# Altium schematic sheet power.SchDoc: POWER
size A3; DocumentNumber: 2; Revision: 0; SheetNumber: 2; SheetTotal: 19
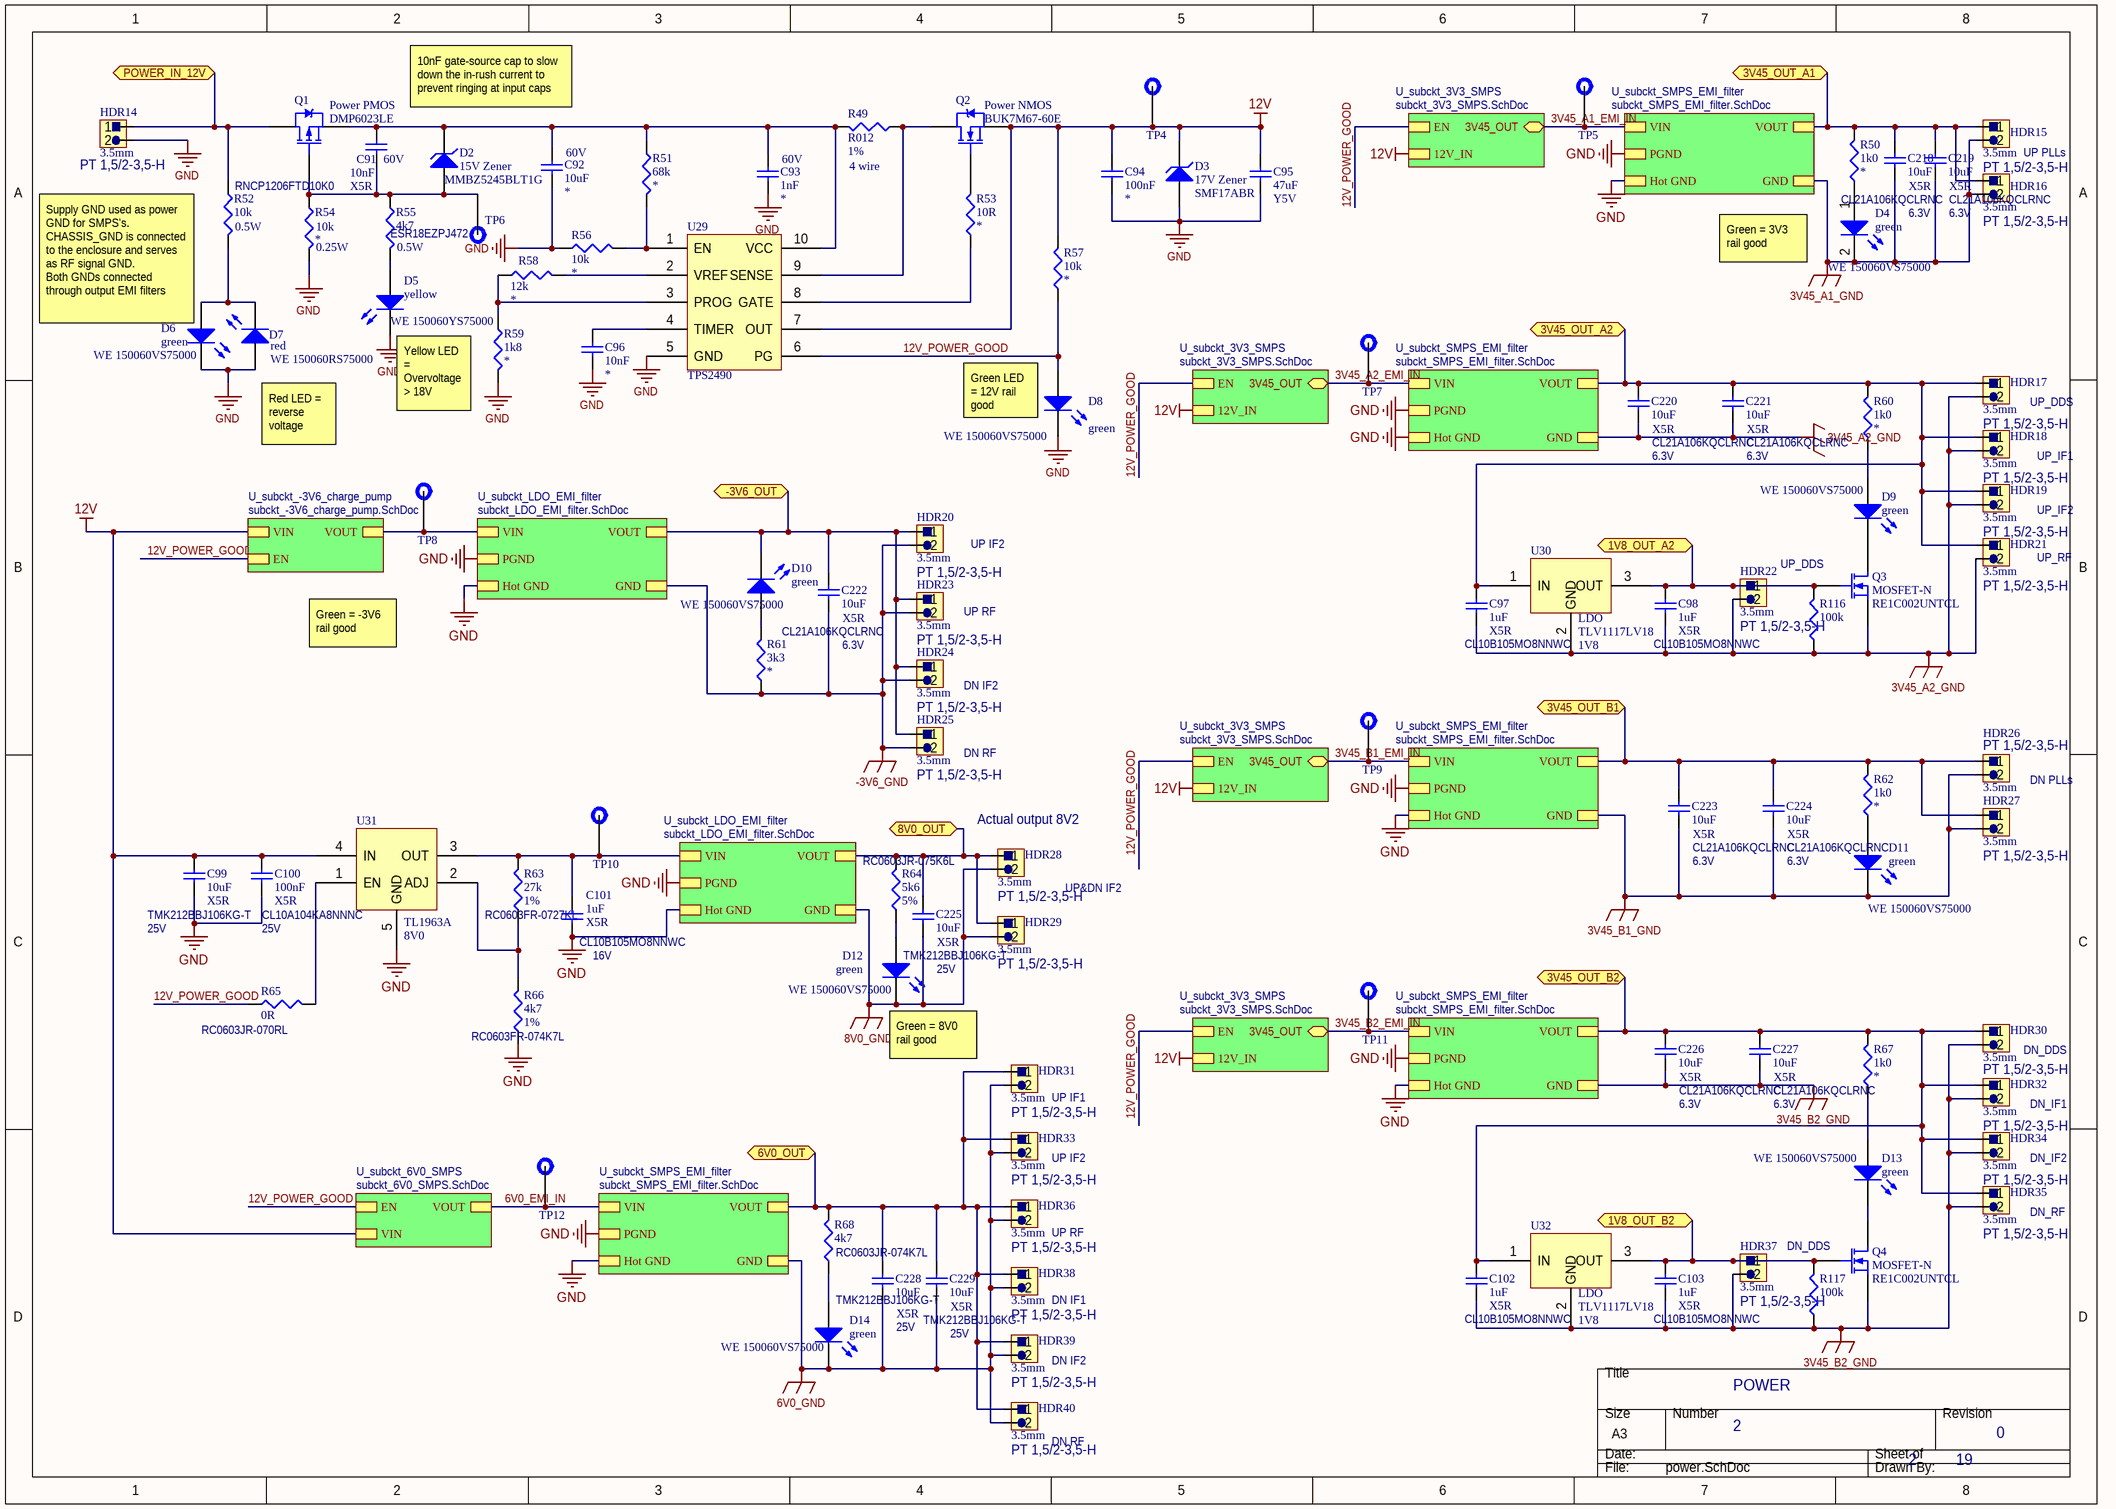
[diagram p0: power.SchDoc]

## Parts
C91  60V  value 10nF  Dielectric: X5R  [TBD]
C92  60V  value 10uF  [TBD]
C93  60V  value 1nF  [TBD]
C94  value 100nF  [TBD]  (hidden comment: Capacitor)
C95  value 47uF  Dielectric: Y5V  [TBD]  (hidden comment: Capacitor)
C96  value 10nF  [TBD]  (hidden comment: Capacitor)
C97  value 1uF  Dielectric: X5R  Model: CL10B105MO8NNWC  [CAP0603]  (hidden comment: Capacitor)
C98  value 1uF  Dielectric: X5R  Model: CL10B105MO8NNWC  [CAP0603]  (hidden comment: Capacitor)
C99  value 10uF  Dielectric: X5R  Model: TMK212BBJ106KG-T  Voltage: 25V  [CAP0805]  (hidden comment: Capacitor)
C100  value 100nF  Dielectric: X5R  Model: CL10A104KA8NNNC  Voltage: 25V  [CAP0603]  (hidden comment: Capacitor)
C101  value 1uF  Dielectric: X5R  Model: CL10B105MO8NNWC  Voltage: 16V  [CAP0603]  (hidden comment: Capacitor)
C102  value 1uF  Dielectric: X5R  Model: CL10B105MO8NNWC  [CAP0603]  (hidden comment: Capacitor)
C103  value 1uF  Dielectric: X5R  Model: CL10B105MO8NNWC  [CAP0603]  (hidden comment: Capacitor)
C218  value 10uF  Dielectric: X5R  Model: CL21A106KQCLRNC  Voltage: 6.3V  [CAP0805]  (hidden comment: Capacitor)
C219  value 10uF  Dielectric: X5R  Model: CL21A106KQCLRNC  Voltage: 6.3V  [CAP0805]  (hidden comment: Capacitor)
C220  value 10uF  Dielectric: X5R  Model: CL21A106KQCLRNC  Voltage: 6.3V  [CAP0805]  (hidden comment: Capacitor)
C221  value 10uF  Dielectric: X5R  Model: CL21A106KQCLRNC  Voltage: 6.3V  [CAP0805]  (hidden comment: Capacitor)
C222  value 10uF  Dielectric: X5R  Model: CL21A106KQCLRNC  Voltage: 6.3V  [CAP0805]  (hidden comment: Capacitor)
C223  value 10uF  Dielectric: X5R  Model: CL21A106KQCLRNC  Voltage: 6.3V  [CAP0805]  (hidden comment: Capacitor)
C224  value 10uF  Dielectric: X5R  Model: CL21A106KQCLRNC  Voltage: 6.3V  [CAP0805]  (hidden comment: Capacitor)
C225  value 10uF  Dielectric: X5R  Model: TMK212BBJ106KG-T  Voltage: 25V  [CAP0805]  (hidden comment: Capacitor)
C226  value 10uF  Dielectric: X5R  Model: CL21A106KQCLRNC  Voltage: 6.3V  [CAP0805]  (hidden comment: Capacitor)
C227  value 10uF  Dielectric: X5R  Model: CL21A106KQCLRNC  Voltage: 6.3V  [CAP0805]  (hidden comment: Capacitor)
C228  value 10uF  Dielectric: X5R  Model: TMK212BBJ106KG-T  Voltage: 25V  [CAP0805]  (hidden comment: Capacitor)
C229  value 10uF  Dielectric: X5R  Model: TMK212BBJ106KG-T  Voltage: 25V  [CAP0805]  (hidden comment: Capacitor)
D2  15V Zener  Model: MMBZ5245BLT1G  [TBD]
D3  17V Zener  Model: SMF17ABR  [TBD]
D4  Colour: green  Model: WE 150060VS75000  [LED0603]  (hidden comment: LED)
D5  Colour: yellow  Model: WE 150060YS75000  [LED0603]  (hidden comment: LED)
D6  Colour: green  Model: WE 150060VS75000  [LED0603]  (hidden comment: LED)
D7  Colour: red  Model: WE 150060RS75000  [LED0603]  (hidden comment: LED)
D8  Colour: green  Model: WE 150060VS75000  [LED0603]  (hidden comment: LED)
D9  Colour: green  Model: WE 150060VS75000  [LED0603]  (hidden comment: LED)
D10  Colour: green  Model: WE 150060VS75000  [LED0603]  (hidden comment: LED)
D11  Colour: green  Model: WE 150060VS75000  [LED0603]  (hidden comment: LED)
D12  Colour: green  Model: WE 150060VS75000  [LED0603]  (hidden comment: LED)
D13  Colour: green  Model: WE 150060VS75000  [LED0603]  (hidden comment: LED)
D14  Colour: green  Model: WE 150060VS75000  [LED0603]  (hidden comment: LED)
HDR14  Pitch: 3.5mm  Model: PT 1,5/2-3,5-H  [2X 3.5mm TH screw terminal - interlock]  (hidden comment: Header 2 pins)
HDR15  Pitch: 3.5mm  Model: PT 1,5/2-3,5-H  [2X 3.5mm TH screw terminal - interlock]  (hidden comment: Header 2 pins)
HDR16  Pitch: 3.5mm  Model: PT 1,5/2-3,5-H  [2X 3.5mm TH screw terminal - interlock]  (hidden comment: Header 2 pins)
HDR17  Pitch: 3.5mm  Model: PT 1,5/2-3,5-H  [2X 3.5mm TH screw terminal - interlock]  (hidden comment: Header 2 pins)
HDR18  Pitch: 3.5mm  Model: PT 1,5/2-3,5-H  [2X 3.5mm TH screw terminal - interlock]  (hidden comment: Header 2 pins)
HDR19  Pitch: 3.5mm  Model: PT 1,5/2-3,5-H  [2X 3.5mm TH screw terminal - interlock]  (hidden comment: Header 2 pins)
HDR20  Pitch: 3.5mm  Model: PT 1,5/2-3,5-H  [2X 3.5mm TH screw terminal - interlock]  (hidden comment: Header 2 pins)
HDR21  Pitch: 3.5mm  Model: PT 1,5/2-3,5-H  [2X 3.5mm TH screw terminal - interlock]  (hidden comment: Header 2 pins)
HDR22  Pitch: 3.5mm  Model: PT 1,5/2-3,5-H  [2X 3.5mm TH screw terminal - interlock]  (hidden comment: Header 2 pins)
HDR23  Pitch: 3.5mm  Model: PT 1,5/2-3,5-H  [2X 3.5mm TH screw terminal - interlock]  (hidden comment: Header 2 pins)
HDR24  Pitch: 3.5mm  Model: PT 1,5/2-3,5-H  [2X 3.5mm TH screw terminal - interlock]  (hidden comment: Header 2 pins)
HDR25  Pitch: 3.5mm  Model: PT 1,5/2-3,5-H  [2X 3.5mm TH screw terminal - interlock]  (hidden comment: Header 2 pins)
HDR26  Pitch: 3.5mm  Model: PT 1,5/2-3,5-H  [2X 3.5mm TH screw terminal - interlock]  (hidden comment: Header 2 pins)
HDR27  Pitch: 3.5mm  Model: PT 1,5/2-3,5-H  [2X 3.5mm TH screw terminal - interlock]  (hidden comment: Header 2 pins)
HDR28  Pitch: 3.5mm  Model: PT 1,5/2-3,5-H  [2X 3.5mm TH screw terminal - interlock]  (hidden comment: Header 2 pins)
HDR29  Pitch: 3.5mm  Model: PT 1,5/2-3,5-H  [2X 3.5mm TH screw terminal - interlock]  (hidden comment: Header 2 pins)
HDR30  Pitch: 3.5mm  Model: PT 1,5/2-3,5-H  [2X 3.5mm TH screw terminal - interlock]  (hidden comment: Header 2 pins)
HDR31  Pitch: 3.5mm  Model: PT 1,5/2-3,5-H  [2X 3.5mm TH screw terminal - interlock]  (hidden comment: Header 2 pins)
HDR32  Pitch: 3.5mm  Model: PT 1,5/2-3,5-H  [2X 3.5mm TH screw terminal - interlock]  (hidden comment: Header 2 pins)
HDR33  Pitch: 3.5mm  Model: PT 1,5/2-3,5-H  [2X 3.5mm TH screw terminal - interlock]  (hidden comment: Header 2 pins)
HDR34  Pitch: 3.5mm  Model: PT 1,5/2-3,5-H  [2X 3.5mm TH screw terminal - interlock]  (hidden comment: Header 2 pins)
HDR35  Pitch: 3.5mm  Model: PT 1,5/2-3,5-H  [2X 3.5mm TH screw terminal - interlock]  (hidden comment: Header 2 pins)
HDR36  Pitch: 3.5mm  Model: PT 1,5/2-3,5-H  [2X 3.5mm TH screw terminal - interlock]  (hidden comment: Header 2 pins)
HDR37  Pitch: 3.5mm  Model: PT 1,5/2-3,5-H  [2X 3.5mm TH screw terminal - interlock]  (hidden comment: Header 2 pins)
HDR38  Pitch: 3.5mm  Model: PT 1,5/2-3,5-H  [2X 3.5mm TH screw terminal - interlock]  (hidden comment: Header 2 pins)
HDR39  Pitch: 3.5mm  Model: PT 1,5/2-3,5-H  [2X 3.5mm TH screw terminal - interlock]  (hidden comment: Header 2 pins)
HDR40  Pitch: 3.5mm  Model: PT 1,5/2-3,5-H  [2X 3.5mm TH screw terminal - interlock]  (hidden comment: Header 2 pins)
Q1  Power PMOS  Model: DMP6023LE
Q2  Power NMOS  Model: BUK7M67-60E  [TBD]
Q3  MOSFET-N  Model: RE1C002UNTCL  [SC89 3 leads]
Q4  MOSFET-N  Model: RE1C002UNTCL  [SC89 3 leads]
R49  4 wire  value R012  Type: 1%  [TBD]
R50  value 1k0  [RES0603]  (hidden comment: Resistor)
R51  value 68k  [TBD]  (hidden comment: Resistor)
R52  0.5W  value 10k  Model: RNCP1206FTD10K0  [RES1206]
R53  value 10R  [TBD]  (hidden comment: Resistor)
R54  0.25W  value 10k  [TBD]
R55  0.5W  value 4k7  Model: ESR18EZPJ472  [RES1206]
R56  value 10k  [TBD]  (hidden comment: Resistor)
R57  value 10k  [TBD]  (hidden comment: Resistor)
R58  value 12k  [TBD]  (hidden comment: Resistor)
R59  value 1k8  [TBD]  (hidden comment: Resistor)
R60  value 1k0  [RES0603]  (hidden comment: Resistor)
R61  value 3k3  [RES0603]  (hidden comment: Resistor)
R62  value 1k0  [RES0603]  (hidden comment: Resistor)
R63  value 27k  Type: 1%  Model: RC0603FR-0727KL  [RES0603]  (hidden comment: Resistor)
R64  value 5k6  Type: 5%  Model: RC0603JR-075K6L  [RES0603]  (hidden comment: Resistor)
R65  value 0R  Model: RC0603JR-070RL  [RES0603]  (hidden comment: Resistor)
R66  value 4k7  Type: 1%  Model: RC0603FR-074K7L  [RES0603]  (hidden comment: Resistor)
R67  value 1k0  [RES0603]  (hidden comment: Resistor)
R68  value 4k7  Model: RC0603JR-074K7L  [RES0603]  (hidden comment: Resistor)
R116  value 100k  [RES0603]  (hidden comment: Resistor)
R117  value 100k  [RES0603]  (hidden comment: Resistor)
TP4  Test point  [1XHeader 100mil]  (value not drawn)  (no BOM)
TP5  Test point  [1XHeader 100mil]  (value not drawn)  (no BOM)
TP6  Test point  [1XHeader 100mil]  (value not drawn)  (no BOM)
TP7  Test point  [1XHeader 100mil]  (value not drawn)  (no BOM)
TP8  Test point  [1XHeader 100mil]  (value not drawn)  (no BOM)
TP9  Test point  [1XHeader 100mil]  (value not drawn)  (no BOM)
TP10  Test point  [1XHeader 100mil]  (value not drawn)  (no BOM)
TP11  Test point  [1XHeader 100mil]  (value not drawn)  (no BOM)
TP12  Test point  [1XHeader 100mil]  (value not drawn)  (no BOM)
U29  TPS2490  [TBD]
U30  LDO  Model: TLV1117LV18  Voltage: 1V8  [SOT223 (4)]
U31  Model: TL1963A  Voltage: 8V0  [SOT223 (6)]  (hidden comment: LDO)
U32  LDO  Model: TLV1117LV18  Voltage: 1V8  [SOT223 (4)]

## Sub-sheets
U_subckt_3V3_SMPS = subckt_3V3_SMPS.SchDoc: EN, 12V_IN, 3V45_OUT
U_subckt_3V3_SMPS = subckt_3V3_SMPS.SchDoc: EN, 12V_IN, 3V45_OUT
U_subckt_3V3_SMPS = subckt_3V3_SMPS.SchDoc: EN, 12V_IN, 3V45_OUT
U_subckt_3V3_SMPS = subckt_3V3_SMPS.SchDoc: EN, 12V_IN, 3V45_OUT
U_subckt_6V0_SMPS = subckt_6V0_SMPS.SchDoc: EN, VIN, VOUT
U_subckt_-3V6_charge_pump = subckt_-3V6_charge_pump.SchDoc: VIN, EN, VOUT
U_subckt_LDO_EMI_filter = subckt_LDO_EMI_filter.SchDoc: VIN, PGND, VOUT, GND, Hot GND
U_subckt_LDO_EMI_filter = subckt_LDO_EMI_filter.SchDoc: VIN, PGND, VOUT, GND, Hot GND
U_subckt_SMPS_EMI_filter = subckt_SMPS_EMI_filter.SchDoc: VIN, PGND, VOUT, GND, Hot GND
U_subckt_SMPS_EMI_filter = subckt_SMPS_EMI_filter.SchDoc: VIN, PGND, VOUT, GND, Hot GND
U_subckt_SMPS_EMI_filter = subckt_SMPS_EMI_filter.SchDoc: VIN, PGND, VOUT, GND, Hot GND
U_subckt_SMPS_EMI_filter = subckt_SMPS_EMI_filter.SchDoc: VIN, PGND, VOUT, GND, Hot GND
U_subckt_SMPS_EMI_filter = subckt_SMPS_EMI_filter.SchDoc: VIN, PGND, VOUT, GND, Hot GND

## Ports
1V8_OUT_A2, 1V8_OUT_B2, 3V45_OUT_A1, 3V45_OUT_A2, 3V45_OUT_B1, 3V45_OUT_B2, 6V0_OUT, 8V0_OUT, -3V6_OUT, POWER_IN_12V

## Nets
3V45_A1_GND: C218.1 C219.1 D4.2(K) HDR15.2 HDR16.2 ; sheet U_subckt_SMPS_EMI_filter/GND
3V45_A2_GND: C97.1 C98.1 C220.1 C221.1 HDR17.2 HDR18.2 HDR19.2 HDR21.2 HDR22.2 Q3.3(S) R116.1 U30.2(GND) ; sheet U_subckt_SMPS_EMI_filter/GND
3V45_B1_GND: C223.1 C224.1 D11.2(K) HDR26.2 HDR27.2 ; sheet U_subckt_SMPS_EMI_filter/GND
3V45_B2_GND: C102.1 C103.1 C226.1 C227.1 HDR30.2 HDR32.2 HDR34.2 HDR35.2 HDR37.2 Q4.3(S) R117.1 U32.2(GND) ; sheet U_subckt_SMPS_EMI_filter/GND
6V0_GND: C228.1 C229.1 D14.2(K) HDR31.2 HDR33.2 HDR36.2 HDR38.2 HDR39.2 HDR40.2 ; sheet U_subckt_SMPS_EMI_filter/GND
8V0_GND: C225.1 D12.2(K) HDR28.2 HDR29.2 ; sheet U_subckt_LDO_EMI_filter/GND
12V: C94.1 C95.2 C99.2 C100.2 D3.2(K) Q2.3(S) R57.2 TP4.1 U29.7(OUT) U31.4(IN) ; sheet U_subckt_3V3_SMPS/12V_IN, sheet U_subckt_3V3_SMPS/12V_IN, sheet U_subckt_3V3_SMPS/12V_IN, sheet U_subckt_3V3_SMPS/12V_IN, sheet U_subckt_6V0_SMPS/VIN, sheet U_subckt_-3V6_charge_pump/VIN
-3V6_GND: C222.1 HDR20.2 HDR23.2 HDR24.2 HDR25.2 R61.2 ; sheet U_subckt_LDO_EMI_filter/GND
GND: C92.2 C93.2 C94.2 C95.1 C96.2 C99.1 C100.1 C101.1 D3.1(A) D5.2(K) D6.2(K) D7.1(A) D8.2(K) HDR14.2 R54.2 R56.1 R59.2 R66.1 U29.5(GND) U31.5(GND) ; sheet U_subckt_SMPS_EMI_filter/PGND, sheet U_subckt_SMPS_EMI_filter/Hot GND, sheet U_subckt_SMPS_EMI_filter/PGND, sheet U_subckt_SMPS_EMI_filter/Hot GND, sheet U_subckt_SMPS_EMI_filter/PGND, sheet U_subckt_SMPS_EMI_filter/Hot GND, sheet U_subckt_SMPS_EMI_filter/PGND, sheet U_subckt_SMPS_EMI_filter/Hot GND, sheet U_subckt_SMPS_EMI_filter/PGND, sheet U_subckt_SMPS_EMI_filter/Hot GND, sheet U_subckt_LDO_EMI_filter/PGND, sheet U_subckt_LDO_EMI_filter/Hot GND, sheet U_subckt_LDO_EMI_filter/PGND, sheet U_subckt_LDO_EMI_filter/Hot GND
1V8_OUT_A2: C98.2 HDR22.1 Q3.2(G) R116.2 U30.3(OUT) ; port 1V8_OUT_A2
1V8_OUT_B2: C103.2 HDR37.1 Q4.2(G) R117.2 U32.3(OUT) ; port 1V8_OUT_B2
3V45_A1_EMI_IN: TP5.1 ; sheet U_subckt_3V3_SMPS/3V45_OUT, sheet U_subckt_SMPS_EMI_filter/VIN
3V45_A2_EMI_IN: TP7.1 ; sheet U_subckt_3V3_SMPS/3V45_OUT, sheet U_subckt_SMPS_EMI_filter/VIN
3V45_B1_EMI_IN: TP9.1 ; sheet U_subckt_3V3_SMPS/3V45_OUT, sheet U_subckt_SMPS_EMI_filter/VIN
3V45_B2_EMI_IN: TP11.1 ; sheet U_subckt_3V3_SMPS/3V45_OUT, sheet U_subckt_SMPS_EMI_filter/VIN
3V45_OUT_A1: C218.2 C219.2 HDR15.1 HDR16.1 R50.2 ; port 3V45_OUT_A1, sheet U_subckt_SMPS_EMI_filter/VOUT
3V45_OUT_A2: C97.2 C220.2 C221.2 HDR17.1 HDR18.1 HDR19.1 HDR21.1 R60.2 U30.1(IN) ; port 3V45_OUT_A2, sheet U_subckt_SMPS_EMI_filter/VOUT
3V45_OUT_B1: C223.2 C224.2 HDR26.1 HDR27.1 R62.2 ; port 3V45_OUT_B1, sheet U_subckt_SMPS_EMI_filter/VOUT
3V45_OUT_B2: C102.2 C226.2 C227.2 HDR30.1 HDR32.1 HDR34.1 HDR35.1 R67.2 U32.1(IN) ; port 3V45_OUT_B2, sheet U_subckt_SMPS_EMI_filter/VOUT
6V0_EMI_IN: TP12.1 ; sheet U_subckt_SMPS_EMI_filter/VIN, sheet U_subckt_6V0_SMPS/VOUT
6V0_OUT: C228.2 C229.2 HDR31.1 HDR33.1 HDR36.1 HDR38.1 HDR39.1 HDR40.1 R68.2 ; port 6V0_OUT, sheet U_subckt_SMPS_EMI_filter/VOUT
8V0_OUT: C225.2 HDR28.1 HDR29.1 R64.2 ; port 8V0_OUT, sheet U_subckt_LDO_EMI_filter/VOUT
12V_POWER_GOOD: D8.1(A) R57.1 R65.1 U29.6(PG) ; sheet U_subckt_3V3_SMPS/EN, sheet U_subckt_3V3_SMPS/EN, sheet U_subckt_3V3_SMPS/EN, sheet U_subckt_3V3_SMPS/EN, sheet U_subckt_6V0_SMPS/EN, sheet U_subckt_-3V6_charge_pump/EN
-3V6_OUT: C222.2 D10.2(K) HDR20.1 HDR23.1 HDR24.1 HDR25.1 ; port -3V6_OUT, sheet U_subckt_LDO_EMI_filter/VOUT
POWER_IN_12V: HDR14.1 Q1.2(D) R52.1 ; port POWER_IN_12V
NetC91_1: C91.1 C92.1 C93.1 D2.2(K) Q1.3(S) R49.2 R51.1 U29.10(VCC)
NetC91_2: C91.2 D2.1(A) Q1.1(G) R54.1 R55.1 TP6.1
NetC96_1: C96.1 U29.4(TIMER)
NetC101_2: C101.2 R63.2 TP10.1 U31.3(OUT) ; sheet U_subckt_LDO_EMI_filter/VIN
NetD4_1: D4.1(A) R50.1
NetD5_1: D5.1(A) R55.2
NetD6_1: D6.1(A) D7.2(K) R52.2
NetD9_1: D9.1(A) R60.1
NetD9_2: D9.2(K) Q3.1(D)
NetD10_1: D10.1(A) R61.1
NetD11_1: D11.1(A) R62.1
NetD12_1: D12.1(A) R64.1
NetD13_1: D13.1(A) R67.1
NetD13_2: D13.2(K) Q4.1(D)
NetD14_1: D14.1(A) R68.1
NetQ2_1: Q2.1(G) R53.2
NetQ2_2: Q2.2(D) R49.1 U29.9(SENSE)
NetR51_2: R51.2 R56.2 U29.1(EN)
NetR53_1: R53.1 U29.8(GATE)
NetR58_1: R58.1 R59.1 U29.3(PROG)
NetR58_2: R58.2 U29.2(VREF)
NetR63_1: R63.1 R66.2 U31.2(ADJ)
NetR65_2: R65.2 U31.1(EN)
NetTP8_1: TP8.1 ; sheet U_subckt_-3V6_charge_pump/VOUT, sheet U_subckt_LDO_EMI_filter/VIN

## Notes on the sheet
- 10nF gate-source cap to slow down the in-rush current to prevent ringing at input caps
- UP PLLs
- (near D6) Supply GND used as power GND for SMPS's.
  CHASSIS_GND is connected to the enclosure and serves as RF signal GND.
  Both GNDs connected through output EMI filters
- Green = 3V3 rail good
- (near D7) Red LED = reverse voltage
- Yellow LED = Overvoltage > 18V
- (near D8) Green LED = 12V rail good
- UP_DDS
- UP_IF1
- UP_IF2
- UP IF2
- UP_RF
- Green = -3V6 rail good
- UP RF
- DN IF2
- (near HDR25) DN RF
- DN PLLs
- (near HDR28) Actual output 8V2
- UP&DN IF2
- Green = 8V0 rail good
- DN_DDS
- UP IF1
- DN_IF1
- DN_IF2
- (near HDR35) DN_RF
- DN IF1
- (near HDR40) DN RF

## Library data of the parts
C91-C93 = Capacitor
  C92 C93: Dielectric: *
D2 D3 = D Zener: Zener Diode
HDR14-HDR40 = Header2
Q1 = Power PMOS: P-Channel Power MOSFET
Q2 = Power NMOS: N-Channel Power MOSFET
Q3 Q4 = MOSFET-N: N-Channel MOSFET; pin to pad: 1>3 2>1 3>2
R49 R52 R54 R55 = Resistor
  R52 R54 R55: Type: *
U29 = TPS2490: High voltage hot swap controller
U30 = LDO_no_EN: LDO w/o EN; pin to pad: 1>3 2>1 3>2 4>none
U31 = LDO_Adj: Adjustable LDO; pin to pad: 2>5 3>4 4>2 5>3
U32 = LDO_no_EN: LDO w/o EN; pin to pad: 1>3 2>1 3>2
C94-C103 C218-C229 = Capacitor
  C94 C96: Dielectric: *
R50 R51 R53 R56-R68 R116 R117 = Resistor
  R50 R51 R53 R56-R62 R65 R67 R68: Type: *
  R116 R117: Type: *; Model: *